# EasyEDA Pro project ProProject_BBM-USB_2024-03-22.epro, schematic BSBM-USB-O
Create Date: 2023-11-26; Page Name: USB HUB; Project Name: BBM-USB; Schematic Name: BSBM-USB-O; Update Date: 2023-12-20; Company: Lenrui.Co.Ltd; Drawed: EasyEDA Pro; Page Size: A4; Part Number: JLCPCB-002; Reviewed: mutethecyberwolf; Version: V0.3
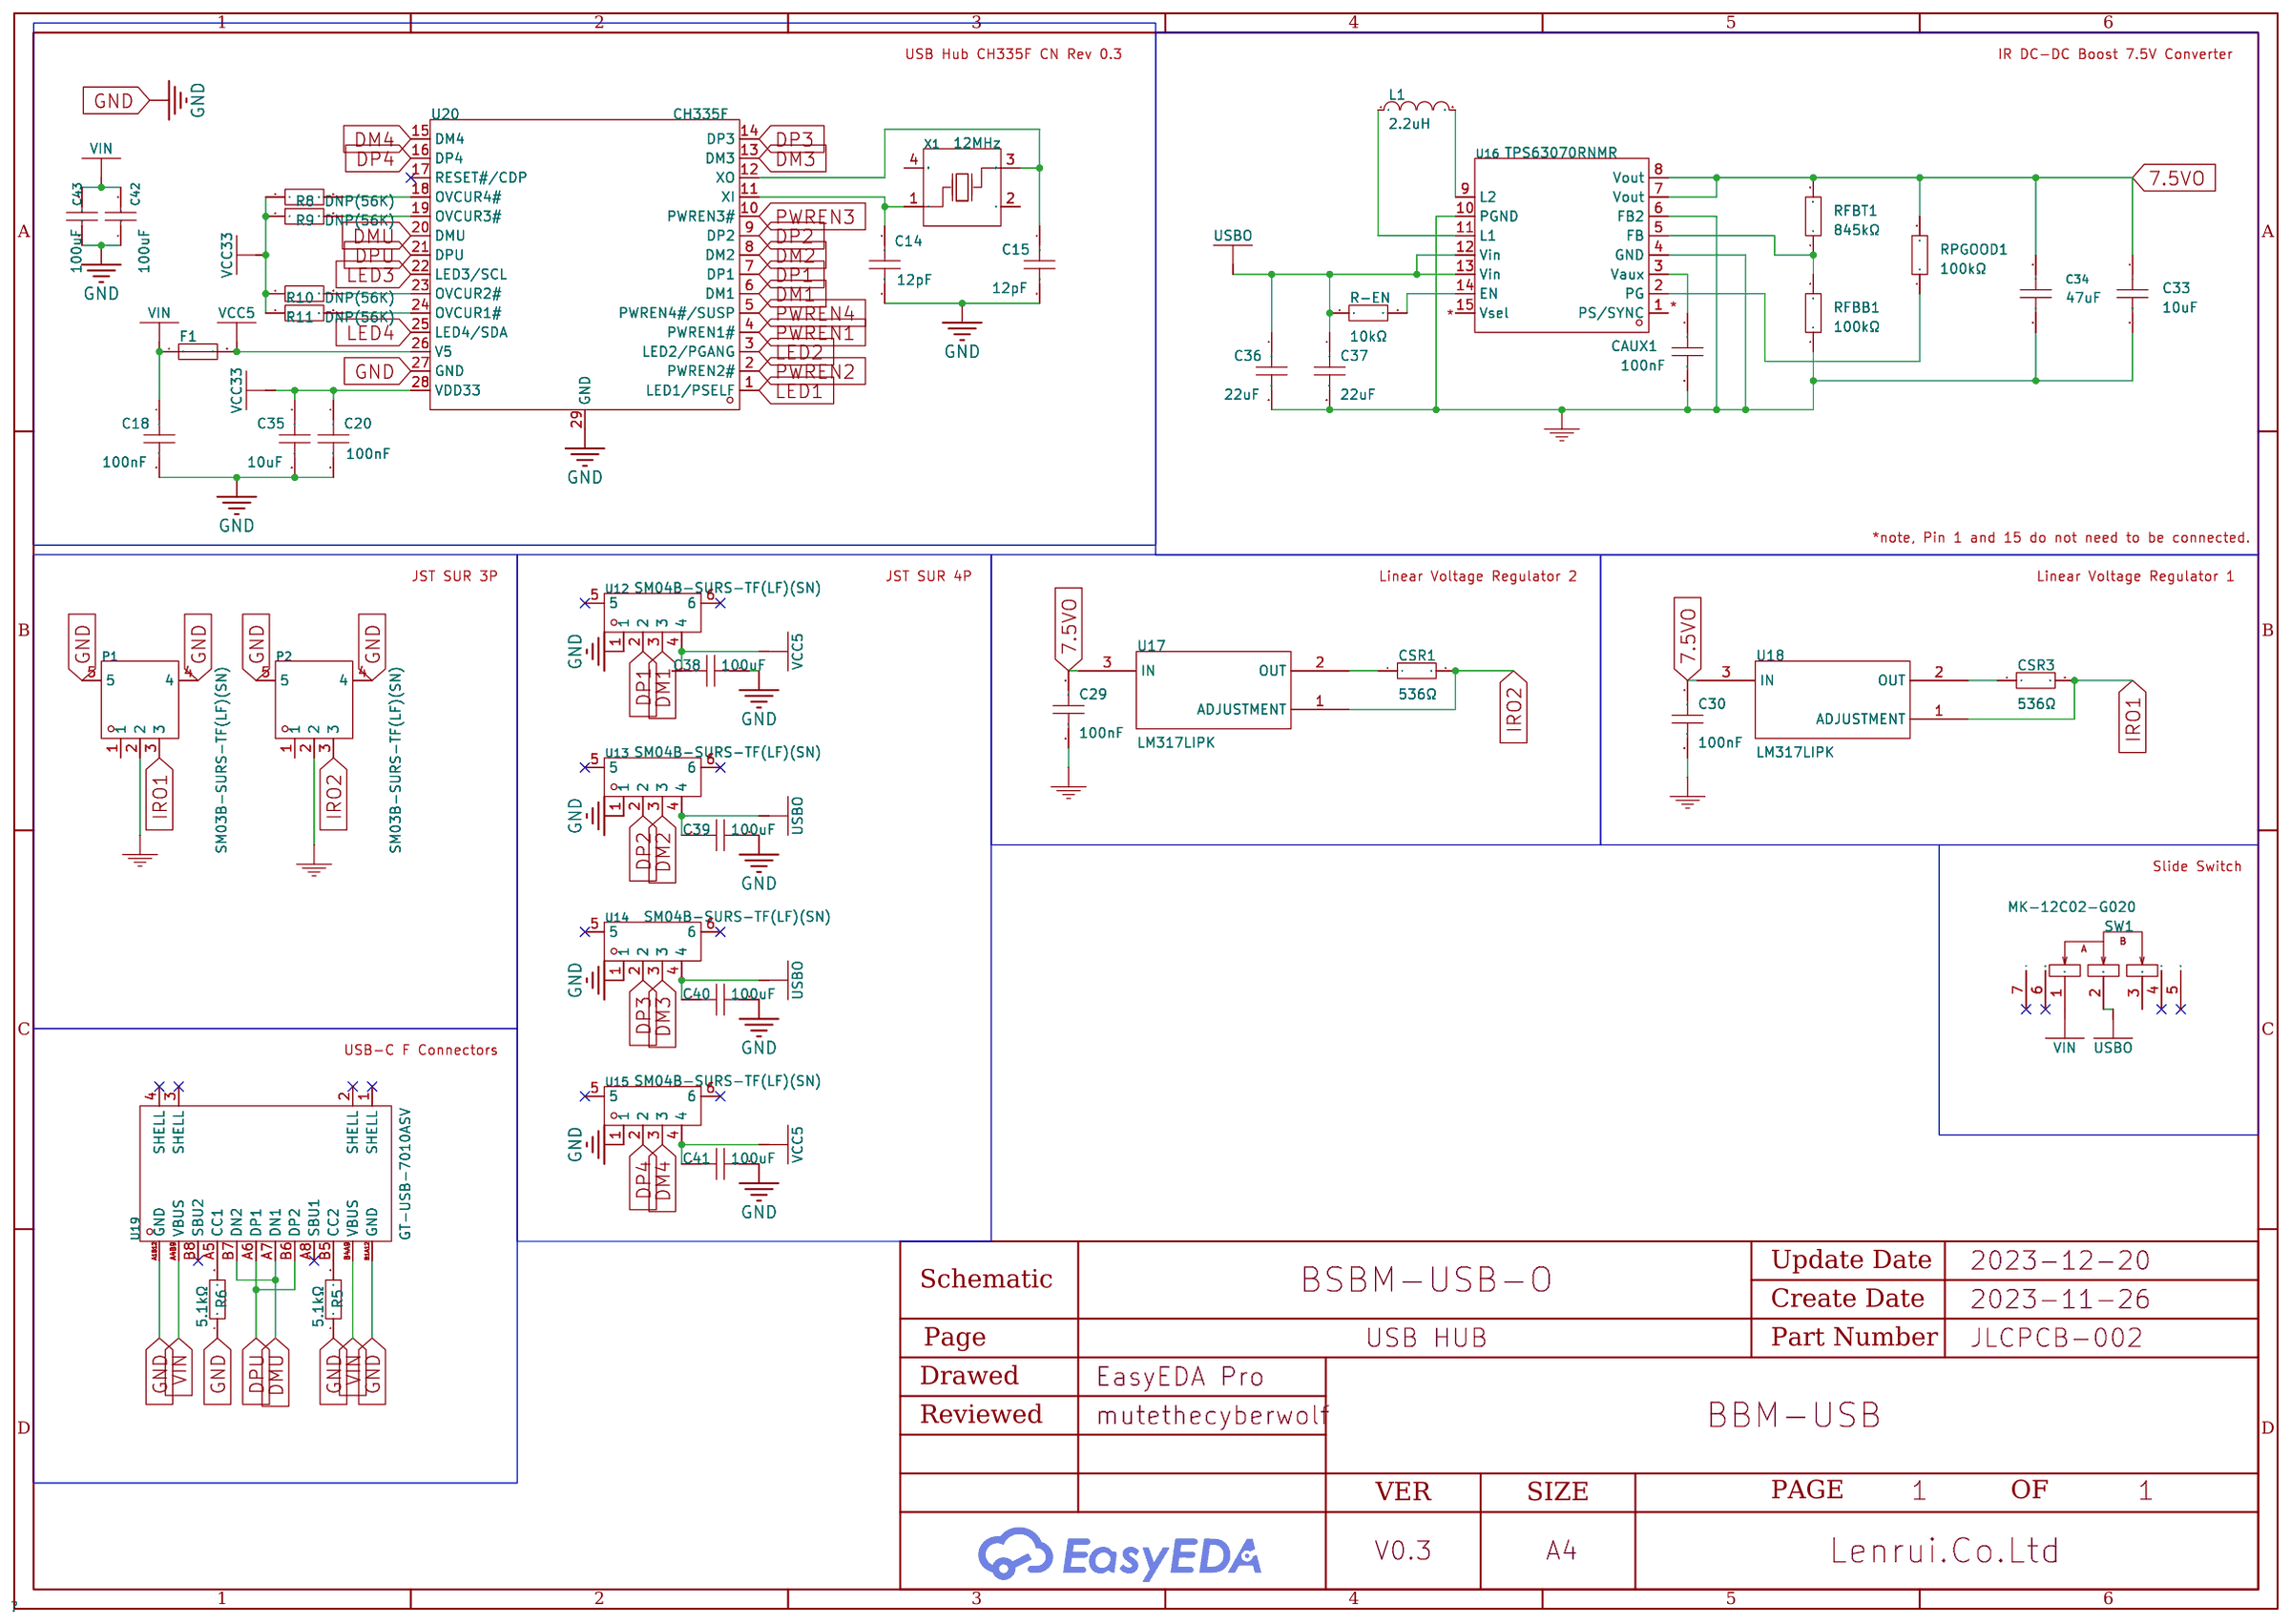
[diagram p0: schematic sheet]

## Parts
C14  12pF  [C0201]
C15  12pF  [C0201]
C18  100nF  [C0201]
C20  100nF  [C0201]
C29  100nF  [C0201]
C30  100nF  [C0201]
C33  10uF  [C0603]
C34  47uF  [C1206]
C35  10uF  [C0603]
C36  22uF  [C0805]
C37  22uF  [C0805]
C38  100uF  [C0603]
C39  100uF  [C0603]
C40  100uF  [C0603]
C41  100uF  [C0603]
C42  100uF  [C1206]
C43  100uF  [C1206]
CAUX1  100nF  [C0201]
CSR1  536Ω  [R0603]
CSR3  536Ω  [R0603]
F1  SMD0805B050TF  [F0805]
L1  2.2uH  [IND-SMD_L4.0-W4.0]
P1  SM03B-SURS-TF(LF)(SN)  [CONN-SMD_SM03B-SURS-TF-LF-SN]
P2  SM03B-SURS-TF(LF)(SN)  [CONN-SMD_SM03B-SURS-TF-LF-SN]
R5  5.1kΩ  [R0402]
R6  5.1kΩ  [R0402]
R8  DNP(56K)  [R0201]
R9  DNP(56K)  [R0201]
R10  DNP(56K)  [R0201]
R11  DNP(56K)  [R0201]
R-EN  10kΩ  [R0201]
RFBB1  100kΩ  [R0201]
RFBT1  845kΩ  [R0201]
RPGOOD1  100kΩ  [R0201]
SW1  MK-12C02-G020  [SW-SMD_MK-12C02-G020]
U12  SM04B-SURS-TF(LF)(SN)  [CONN-SMD_SM04B-SURS-TF-LF-SN]
U13  SM04B-SURS-TF(LF)(SN)  [CONN-SMD_SM04B-SURS-TF-LF-SN]
U14  SM04B-SURS-TF(LF)(SN)  [CONN-SMD_SM04B-SURS-TF-LF-SN]
U15  SM04B-SURS-TF(LF)(SN)  [CONN-SMD_SM04B-SURS-TF-LF-SN]
U16  TPS63070RNMR  [VQFN-HR-15_L3.0-W2.5-P0.50-BL_TPS63070RNMR]
U17  LM317LIPK  [SOT-89_L4.5-W2.5-P1.50-LS4.2-BR]
U18  LM317LIPK  [SOT-89_L4.5-W2.5-P1.50-LS4.2-BR]
U19  GT-USB-7010ASV  [USB-C-SMD_G-SWITCH_GT-USB-7010ASV]
U20  CH335F  [QFN-28_L4.0-W4.0-P0.40-TL-EP2.8]
X1  12MHz  [OSC-SMD_4P-L3.2-W2.5-BL]

## Library data of the parts
C14 C15 C18 C20 C29 C30 CAUX1 = CAP_0201: Supplier Footprint: 0201
C33 C35 C38-C41 = CAP_0603: Supplier Footprint: 0603
C34 = GRM31CR61E476ME44L: Capacitance:Tolerance:±20%Tolerance:±20%VoltageRated:TemperatureCoefficient:; LCSC Part Name: 47uF±20%25V; Supplier Part: C403725; Manufacturer: muRata(村田); Supplier Footprint: 1206; JLCPCB Part Class: ExtendedPart; Datasheet: https://atta.szlcsc.com/upload/public/pdf/source/20191025/C403725_B8A8CD2FFA1F57E6FDF268BD106459D5.pdf; Supplier: LCSC; Tolerance: ±20%
C36 C37 = CAP_0805: Supplier Footprint: 0805
C42 C43 = CL31A107MQHNNNE: Capacitance: Tolerance:±20% Tolerance:±20% Voltage Rated: Temperature Coefficient:; LCSC Part Name: 100uF ±20% 6.3V; Supplier Part: C15008; Manufacturer: SAMSUNG(三星); Supplier Footprint: 1206; JLCPCB Part Class: Basic Part; Datasheet: https://atta.szlcsc.com/upload/public/pdf/source/20160218/1457707763339.pdf; Supplier: LCSC; Tolerance: ±20%
CSR1 CSR3 = WR06X5360FTL: Resistance:Tolerance:±1%Tolerance:±1%Power(Watts):TemperatureCoefficient:±100ppm/℃TemperatureCoefficient:±100ppm/℃OverloadVoltage(Max):OperatingTemperatureRange:-55℃~+155℃OperatingTemperatureRange:-55℃~+155℃; LCSC Part Name: 536Ω±1%100mW; Supplier Part: C170624; Manufacturer: Walsin(华新科); Supplier Footprint: 0603; JLCPCB Part Class: ExtendedPart; Datasheet: https://atta.szlcsc.com/upload/public/pdf/source/20180228/C170624_15198091078231378660.pdf; Supplier: LCSC; Tolerance: ±1%; Temperature Coefficient: ±100ppm/℃; Operating Temperature Range: -55℃~+155℃
F1 = SMD0805B050TF: Operating Voltage (Max):6V Current Rating (Max):100A Hold Current:500mA Trip Current:1A Maximum Time to Trip:100ms; LCSC Part Name: 6V 500mA 0805自恢复; Supplier Part: C269104; Manufacturer: Brightking(君耀电子); Supplier Footprint: 0805; JLCPCB Part Class: Extended Part; Datasheet: https://atta.szlcsc.com/upload/public/pdf/source/20180814/C269104_466839A5DB65F6E723CA6A162ACE747B.pdf; Supplier: LCSC; Operating Voltage (Max): 6V; Current Rating (Max): 100A; Hold Current: 500mA; Trip Current: 1A; Maximum Time to Trip: 100ms
L1 = WPN4020H2R2MT: Type:-Inductance:Tolerance:±20%Tolerance:±20%RatedCurrent:SaturationCurrent(Isat):7.6ADCResistance(DCR):Ratings:-; LCSC Part Name: 2.2uH±20%7.6A; Supplier Part: C98361; Manufacturer: Sunlord(顺络); Supplier Footprint: SMD; JLCPCB Part Class: ExtendedPart; Datasheet: https://atta.szlcsc.com/upload/public/pdf/source/20210916/5D33DED32780FEB7D0AA8BED8FC93477.pdf; Supplier: LCSC; Tolerance: ±20%; Saturation Current (Isat): 7.6A
P1 P2 = SM03B-SURS-TF(LF)(SN): ReferenceSeries:-Pitch:0.8mmPinsStructure:1x3PNumberofRows:1NumberofPINsPerRow:3RowSpacing:-MountingStyle:SurfaceMountCurrentRating(Max):0.2AContactMaterial:CopperAlloyContactPlating:TinOperatingTemperatureRange:-25℃~+85℃Opera; LCSC Part Name: 间距:0.8mm1x3P卧贴; Supplier Part: C265338; Manufacturer: JST; Supplier Footprint: SMD,P=0.8mm; JLCPCB Part Class: ExtendedPart; Datasheet: https://atta.szlcsc.com/upload/public/pdf/source/20181024/C265338_702D15F48FA60E6C7B4D89568DD789A2.pdf; Supplier: LCSC; Pitch: 0.8mm; Pins Structure: 1x3P; Number of Rows: 1; Number of PINs Per Row: 3; Mounting Style: SurfaceMount; Current Rating (Max): 0.2A; Contact Material: CopperAlloy; Contact Plating: Tin; Operating Temperature Range: -25℃~+85℃
R5 R6 = Res_0402: Supplier Footprint: 0402
R8-R11 R-EN RFBB1 RFBT1 RPGOOD1 = Res_0201: Supplier Footprint: 0201
SW1 = MK-12C02-G020: LCSC Part Name: 微型拨动开关; Supplier Part: C963206; Manufacturer: G-Switch(品赞); Supplier Footprint: SMD,6.7x2.3x1.4mm; JLCPCB Part Class: ExtendedPart; Datasheet: https://atta.szlcsc.com/upload/public/pdf/source/20200902/C778186_2AF08473ED98414D93A175E8814EEFA6.pdf; Supplier: LCSC
U12-U15 = SM04B-SURS-TF(LF)(SN): PinsStructure:1x4PPitch:0.8mmGender:公MountingStyle:SurfaceMountRowSpacing:-NumberofRows:1NumberofPINsPerRow:4ReferenceSeries:-CurrentRating(Max):0.2AContactMaterial:CopperAlloyContactPlating:TinOperatingTemperatureRange:-25℃~+; LCSC Part Name: 1x4P间距:0.8mm卧贴; Supplier Part: C545754; Manufacturer: JST; Supplier Footprint: SMD,P=0.8mm; JLCPCB Part Class: ExtendedPart; Datasheet: https://atta.szlcsc.com/upload/public/pdf/source/20200721/C545754_707EF2DB36147EA26D9225FCA163A6BC.pdf; Supplier: LCSC; Pins Structure: 1x4P; Pitch: 0.8mm; Gender: 公; Mounting Style: SurfaceMount; Number of Rows: 1; Number of PINs Per Row: 4; Current Rating (Max): 0.2A; Contact Material: CopperAlloy; Contact Plating: Tin; Operating Temperature Range: -25℃~+85℃
U16 = TPS63070RNMR: Function:Buck-boosttypeSynchronousRectification:YesOutputType:AdjustableNumberofOutputs:1Topology:Step-down-BoostInputVoltage:2V~16VInputVoltage:2V~16VOutputVoltage:2.5V~9VOutputVoltage:2.5V~9VOutputCurrent(Max):3.6ASwitchingFrequenc; Supplier Part: C109322; Manufacturer: TI(德州仪器); Supplier Footprint: VQFN-15-HR(2.5x3); JLCPCB Part Class: ExtendedPart; Datasheet: https://www.ti.com/cn/lit/gpn/tps63070; Supplier: LCSC; Function: Buck-boosttype; Synchronous Rectification: Yes; Output Type: Adjustable; Number of Outputs: 1; Topology: Step-down-Boost; Input Voltage: 2V~16V; Output Voltage: 2.5V~9V; Output Current (Max): 3.6A; Switching Frequency: 2.4MHz; Operating Temperature: -40℃~+125℃@(TJ)
U17 U18 = LM317LIPK_C112537: OutputType:OutputPolarity:PositiveNumberofOutputs:1MaximumInputVoltage:38VOutputVoltage:1.2V~32VOutputVoltage:1.2V~32VDropoutVoltage:-OutputCurrent:100mAPowerSupplyRejectionRatio(PSRR):80dB@(120Hz); LCSC Part Name: ADJ输入38V输出1.2V~32V100mA; Supplier Part: C112537; Manufacturer: TI(德州仪器); Supplier Footprint: SOT-89; JLCPCB Part Class: ExtendedPart; Datasheet: https://atta.szlcsc.com/upload/public/pdf/source/20170810/C112537_1502335164377879683.pdf; Supplier: LCSC; Output Polarity: Positive; Number of Outputs: 1; Maximum Input Voltage: 38V; Output Voltage: 1.2V~32V; Output Current: 100mA; Power Supply Rejection Ratio (PSRR): 80dB@(120Hz)
U19 = GT-USB-7010ASV: Connector Type:Type-C Standard:USB 2.0 Gender:Female Number of Contacts:16P Number of Ports:1 Mounting Style:Surface Mount Current Rating - Power (Max):3A Contact Material:高导铜 Contact Plating:Gold Operating Temperature Range:-40℃~+85℃ Operating Temperatur; LCSC Part Name: Type-C 母 卧贴; Supplier Part: C2988369; Manufacturer: G-Switch(品赞); Supplier Footprint: SMD; JLCPCB Part Class: Extended Part; Datasheet: https://atta.szlcsc.com/upload/public/pdf/source/20230327/DF227B64686AC8FA0AD1775797F2C3F1.pdf; Supplier: LCSC; Connector Type: Type-C; Standard: USB 2.0; Gender: Female; Number of Contacts: 16P; Number of Ports: 1; Mounting Style: Surface Mount; Current Rating - Power (Max): 3A; Contact Material: 高导铜; Contact Plating: Gold; Operating Temperature Range: -40℃~+85℃
U20 = CH335F: Supplier Part: C9900042585; Supplier Footprint: QFN28_4x4; Supplier: LCSC
X1 = X322512MSB4SI: Crystal Type:SMD Crystal Resonator Frequency: Load Capacitance: Frequency Tolerance:±10ppm Frequency Tolerance:±10ppm Frequency Stability:±30ppm Frequency Stability:±30ppm Operating Temperature: Operating Temperature:; LCSC Part Name: 12MHz ±10ppm 20pF YSX321SL; Supplier Part: C9002; Manufacturer: YXC(扬兴晶振); Supplier Footprint: SMD3225-4P; JLCPCB Part Class: Basic Part; Datasheet: https://atta.szlcsc.com/upload/public/pdf/source/20210329/C112971_1F611BDC486E193C1706F6D8EB5AA189.pdf; Supplier: LCSC; Crystal Type: SMD Crystal Resonator; Frequency Tolerance: ±10ppm; Frequency Stability: ±30ppm

## Nets
7.5VO: C29.2 C30.1 C33.1 C34.2 RFBT1.2 RPGOOD1.2 U16.7(Vout) U16.8(Vout) U17.3(IN) U18.3(IN)
GND: C14.2 C15.2 C18.2 C20.2 C29.1 C30.2 C33.2 C34.1 C35.2 C36.2 C37.2 C38.1 C39.2 C40.2 C41.2 C42.1 C43.1 CAUX1.2 P1.2 P1.4 P1.5 P2.2 P2.4 P2.5 R5.1 R6.1 RFBB1.1 U12.1 U13.1 U14.1 U15.1 U16.4(GND) U16.6(FB2) U16.10(PGND) U19.A1B12(GND) U19.B1A12(GND) U20.27(GND) U20.29(GND)
VCC5: C38.2 C41.1 F1.2 U12.4 U15.4 U20.26(V5)
VCC33: C20.1 C35.1 R8.1 R9.1 R10.1 R11.1 U20.28(VDD33)
VIN: C18.1 C42.2 C43.2 F1.1 SW1.1 U19.A4B9(VBUS) U19.B4A9(VBUS)
CSR1: CSR1.1 U17.2(OUT)
CSR3: CSR3.1 U18.2(OUT)
DM1: U12.3 U20.6(DM1)
DM2: U13.3 U20.8(DM2)
DM3: U14.3 U20.13(DM3)
DM4: U15.3 U20.15(DM4)
DMU: U19.A7(DN1) U19.B7(DN2) U20.20(DMU)
DP1: U12.2 U20.7(DP1)
DP2: U13.2 U20.9(DP2)
DP3: U14.2 U20.14(DP3)
DP4: U15.2 U20.16(DP4)
DPU: U19.A6(DP1) U19.B6(DP2) U20.21(DPU)
EN: R-EN.2 U16.14(EN)
FB: RFBB1.2 RFBT1.1 U16.5(FB)
IRO1: CSR3.2 P1.3 U18.1(ADJUSTMENT)
IRO2: CSR1.2 P2.3 U17.1(ADJUSTMENT)
L1: L1.1 U16.11(L1)
L2: L1.2 U16.9(L2)
LED1: U20.1(LED1/PSELF)
LED2: U20.3(LED2/PGANG)
LED3: U20.22(LED3/SCL)
LED4: U20.25(LED4/SDA)
OVCUR1: R11.2 U20.24(OVCUR1#)
OVCUR2: R10.2 U20.23(OVCUR2#)
OVCUR3: R9.2 U20.19(OVCUR3#)
OVCUR4: R8.2 U20.18(OVCUR4#)
PG: RPGOOD1.1 U16.2(PG)
PWREN1: U20.4(PWREN1#)
PWREN2: U20.2(PWREN2#)
PWREN3: U20.10(PWREN3#)
PWREN4: U20.5(PWREN4#/SUSP)
USBO: C36.1 C37.1 C39.1 C40.1 R-EN.1 SW1.2 U13.4 U14.4 U16.12(Vin) U16.13(Vin)
VAUX: CAUX1.1 U16.3(Vaux)
XI: C14.1 U20.11(XI) X1.1(OSC1)
XO: C15.1 U20.12(XO) X1.3(OSC2)
$1N11513: R5.2 U19.B5(CC2)
$1N11542: R6.2 U19.A5(CC1)

Not connected (* = marked no-connect by the designer): P1 1; P2 1; SW1 3 4* 5* 6* 7*; U12 5* 6*; U13 5* 6*; U14 5* 6*; U15 5* 6*; U16 1(PS/SYNC) 15(Vsel); U19 1(SHELL)* 2(SHELL)* 3(SHELL)* 4(SHELL)* A8(SBU1)* B8(SBU2)*; U20 17(RESET#/CDP)*; X1 2(GND) 4(GND)

## Notes on the sheet
- USB Hub CH335F CN Rev 0.3
- IR DC-DC Boost 7.5V Converter
- *
- *
- *note, Pin 1 and 15 do not need to be connected.
- JST SUR 3P
- JST SUR 4P
- Linear Voltage Regulator 2
- Linear Voltage Regulator 1
- Slide Switch
- USB-C F Connectors
